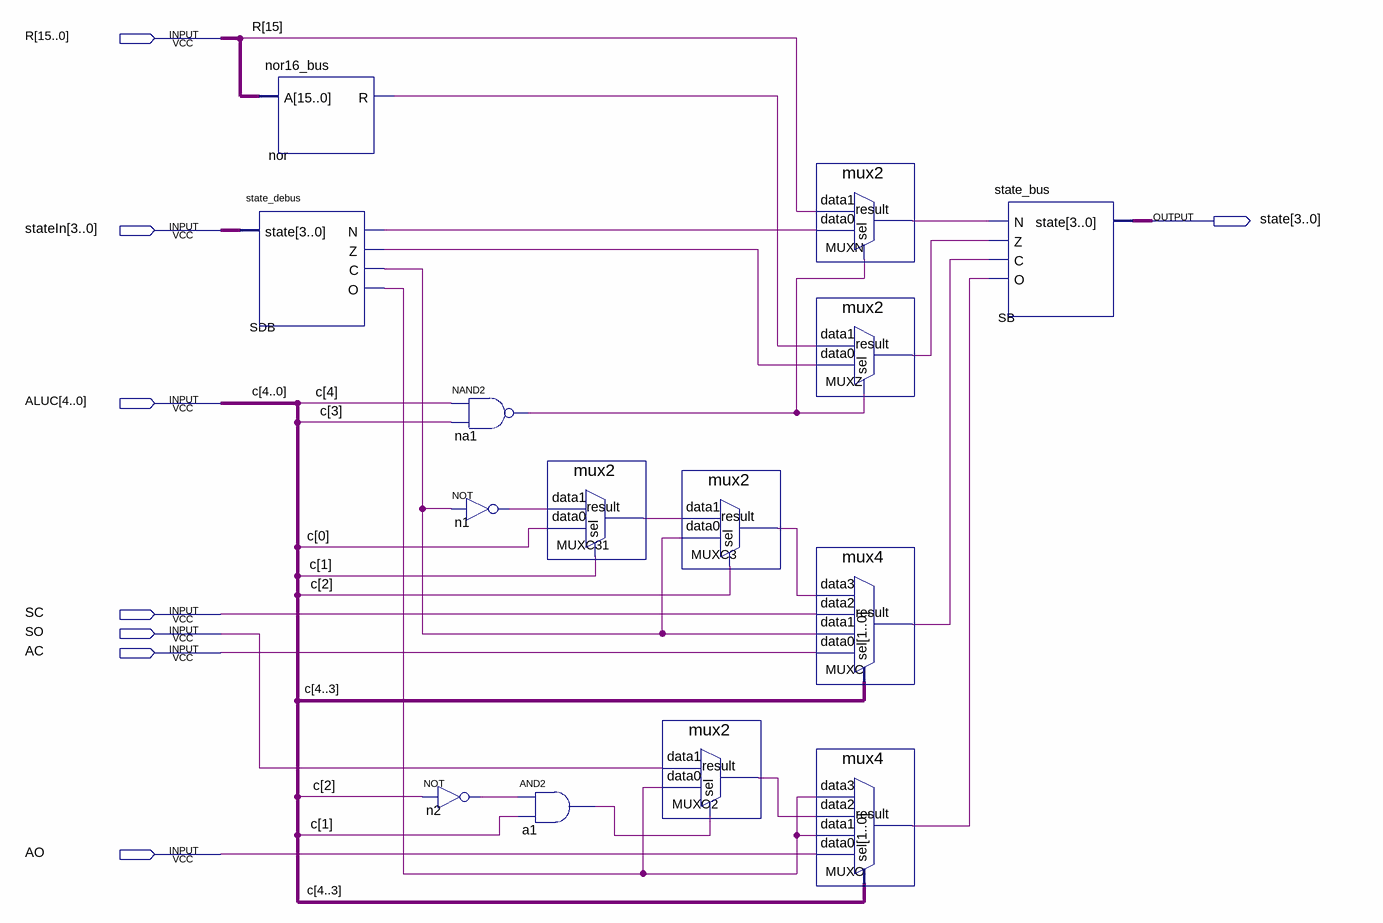
[diagram p0: schematic sheet]
// Quartus schematic state_control.bdf as structural Verilog: 14 symbols, 8 pins
module state_control (
  input  [15:0] R,
  input  [3:0] stateIn,
  input  [4:0] ALUC,
  input  SC,
  input  SO,
  input  AC,
  input  AO,
  output [3:0] state
);

  wire a1_out, MUXC3_result, MUXC31_result, MUXC_result, MUXN_result, MUXO2_result, MUXO_result, MUXZ_result,
       n1_out, n2_out, na1_out, nor_r, SDB_c, SDB_n, SDB_o, SDB_z;

  nor16_bus \nor  (.A(R), .R(nor_r));
  state_debus SDB (.state(stateIn), .N(SDB_n), .Z(SDB_z), .C(SDB_c), .O(SDB_o));
  not n2 (n2_out, ALUC[2]);
  nand na1 (na1_out, ALUC[4], ALUC[3]);
  not n1 (n1_out, SDB_c);
  mux2 MUXC31 (.data1(n1_out), .data0(ALUC[0]), .sel(ALUC[1]), .result(MUXC31_result));
  and a1 (a1_out, n2_out, ALUC[1]);
  mux2 MUXO2 (.data1(SO), .data0(SDB_o), .sel(a1_out), .result(MUXO2_result));
  mux2 MUXC3 (.data1(MUXC31_result), .data0(SDB_c), .sel(ALUC[2]), .result(MUXC3_result));
  mux2 MUXN (.data1(R[15]), .data0(SDB_n), .sel(na1_out), .result(MUXN_result));
  mux2 MUXZ (.data1(nor_r), .data0(SDB_z), .sel(na1_out), .result(MUXZ_result));
  mux4 MUXC (.data3(MUXC3_result), .data2(SC), .data1(SDB_c), .data0(AC), .sel(ALUC[4:3]), .result(MUXC_result));
  mux4 MUXO (.data3(SDB_o), .data2(MUXO2_result), .data1(SDB_o), .data0(AO), .sel(ALUC[4:3]), .result(MUXO_result));
  state_bus SB (.N(MUXN_result), .Z(MUXZ_result), .C(MUXC_result), .O(MUXO_result), .state(state));

  // Other names for the same wires on the sheet: c[4:0] = ALUC
endmodule
